# Altium schematic sheet design_23.SchDoc: design
size 414 x 279 mm; Date: 1/25/2021 11:39:22 PM; SheetNumber: 24; Origin: Eagle; GateName_1: G$1; SymbolName_1: A3-L-GUMSTIX; LibraryName: qualified_1; DeviceSetName: A3-L-GUMSTIX; A: A; B: B; C: C; D: D; E: E; F: F; G: G; H: H; 1: 1; 2: 2; 3: 3; 4: 4; 5: 5; Sheet: Sheet:; C:/Gumstix/gumstix-logo-16.bmp: C:/Gumstix/gumstix-logo-16.bmp; Board: Board:
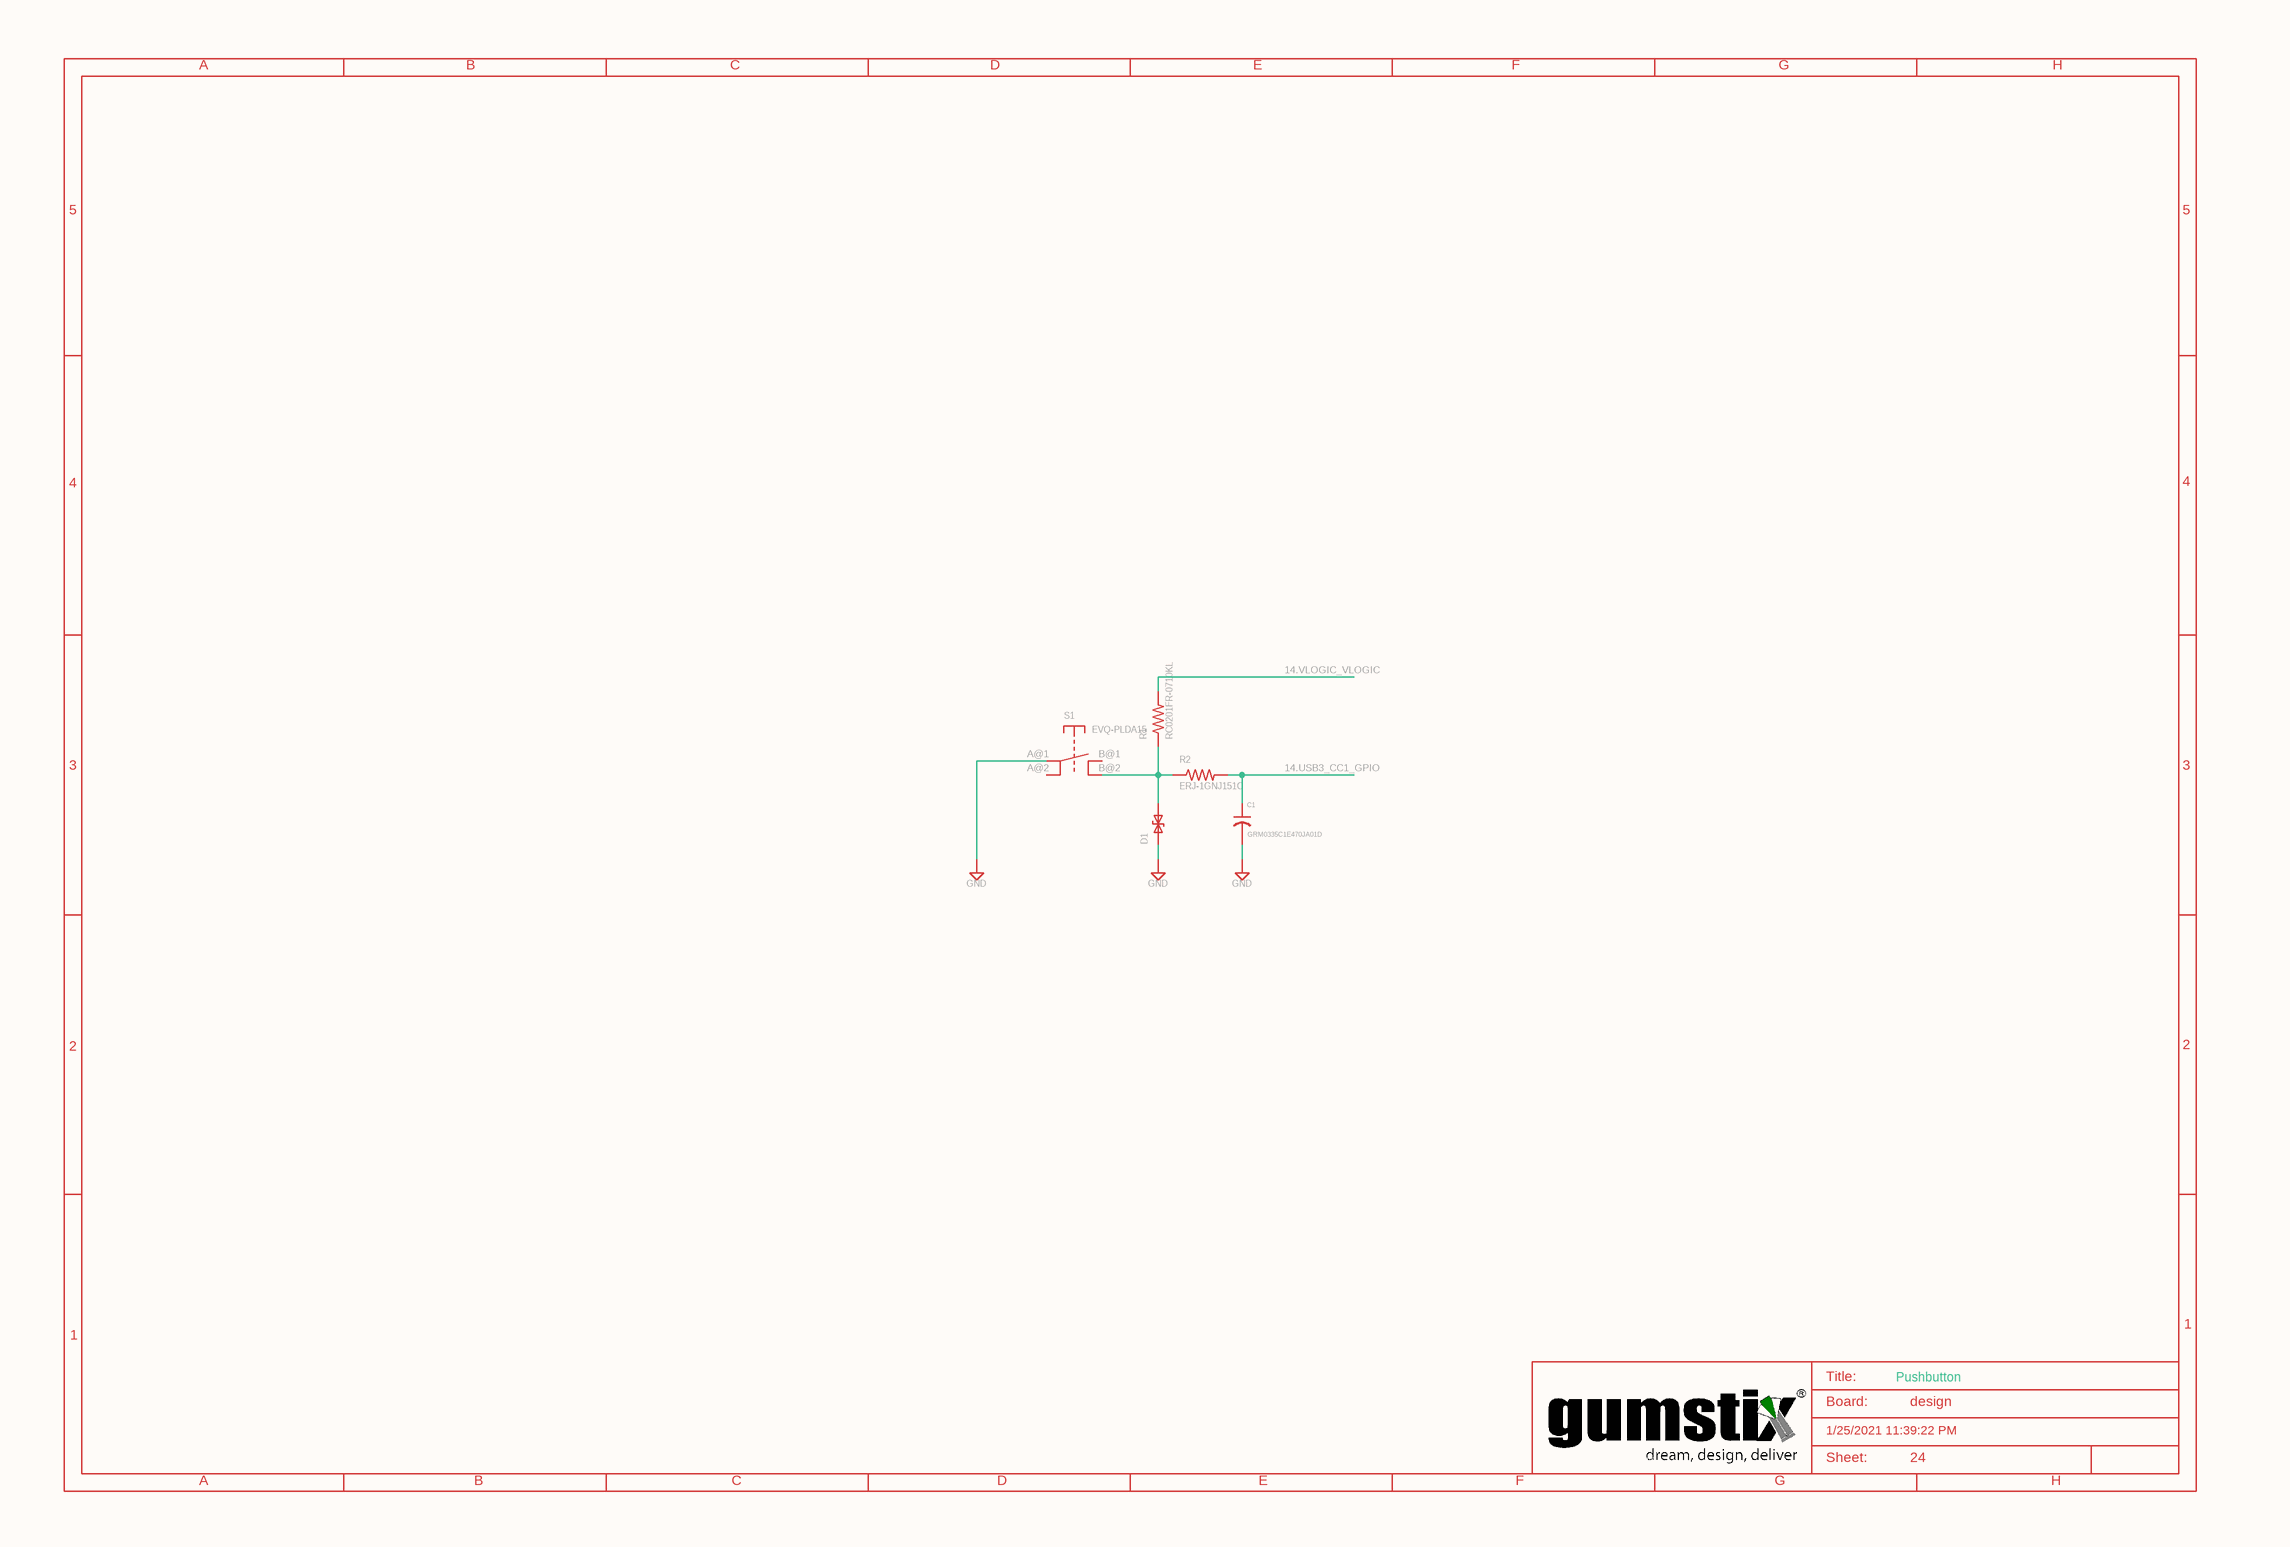
[diagram p0: design_23.SchDoc]

## Parts
C1  GRM0335C1E470JA01D  [0201]
D1  B72590D0050A060  [D0402]  (value not drawn)
R1  RC0201FR-0710KL  [0201]
R2  ERJ-1GNJ151C  [0201]
S1  EVQ-PLDA15  [EVQ]
SUPPLY1  GND
SUPPLY2  GND
SUPPLY3  GND

## Nets
14.USB3_CC1_GPIO: C1.1 R2.2
14.VLOGIC_VLOGIC: R1.2
NetC1_2: C1.2 SUPPLY2.?1(GND)
NetD1_P1: D1.P1 SUPPLY3.?1(GND)
NetD1_P2: D1.P2 R1.1 R2.1 S1.B@2(B')
NetS1_A@1: S1.A@1(A) SUPPLY1.?1(GND)

Not connected (* = marked no-connect by the designer): S1 A@2(A') B@1(B)

## Notes on the sheet
- A
- B
- C
- D
- E
- F
- G
- H
- 5
- 4
- 3
- 2
- 1
- Title:
- Board:
- Pushbutton
- design
- C:/Gumstix/gumstix-logo-16.bmp
- 1/25/2021 11:39:22 PM
- Sheet:
- 24

## Library data of the parts
C1 = GRM0335C1E470JA01D: GateName_1: G$1; SymbolName_1: C-US; LibraryName: qualified_1; DeviceSetName: GRM0335C1E470JA01D; HEIGHT: 0.25
D1 = B72590D0050A060: GateName_1: G$1; SymbolName_1: ESD-DIODE; LibraryName: qualified_1; DeviceSetName: B72590D0050A060; HEIGHT: 0.35
R1 = RC0201FR-0710KL: GateName_1: G$1; SymbolName_1: R-US; LibraryName: qualified_1; DeviceSetName: RC0201FR-0710KL; HEIGHT: 0.25
R2 = ERJ-1GNJ151C: GateName_1: G$1; SymbolName_1: R-US; LibraryName: qualified_1; DeviceSetName: ERJ-1GNJ151C; HEIGHT: 0.25
S1 = EVQ-PLDA15: GateName_1: G$1; SymbolName_1: TS-; LibraryName: qualified_1; DeviceSetName: EVQ-PLDA15; HEIGHT: 2
SUPPLY1-SUPPLY3 = GND: SUPPLY SYMBOL; SymbolName_1: GND-2; GateName_1: GND; LibraryName: qualified_1; DeviceSetName: GND